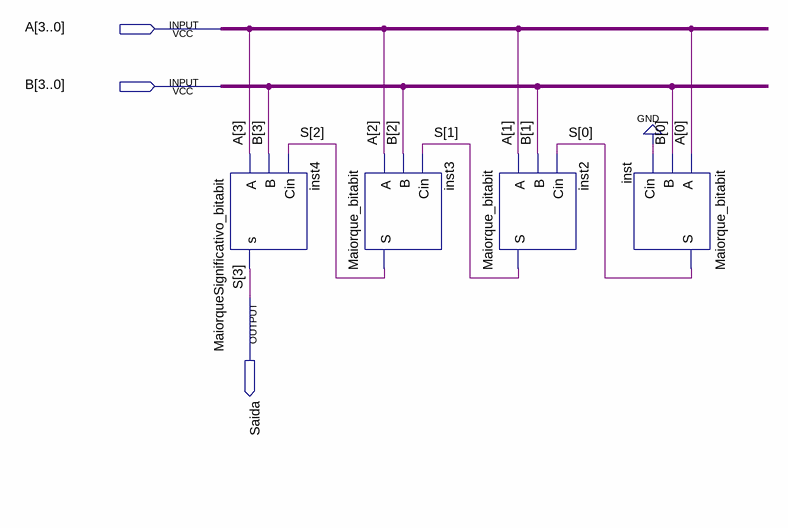
[diagram p0: schematic sheet]
// Quartus schematic Maiorque4bits.bdf as structural Verilog: 4 symbols, 3 pins
module Maiorque4bits (
  input  [3:0] A,
  input  [3:0] B,
  output Saida
);

  wire [2:0] S;

  MaiorqueSignificativo_bitabit inst4 (.A(A[3]), .B(B[3]), .Cin(S[2]), .s(Saida));
  Maiorque_bitabit inst3 (.A(A[2]), .B(B[2]), .Cin(S[1]), .S(S[2]));
  Maiorque_bitabit inst2 (.A(A[1]), .B(B[1]), .Cin(S[0]), .S(S[1]));
  Maiorque_bitabit inst (.A(A[0]), .B(B[0]), .Cin(1'b0), .S(S[0]));

  // Other names for the same wires on the sheet: S[3] = Saida
endmodule
